# Altium project KVM Switch.PrjPcb
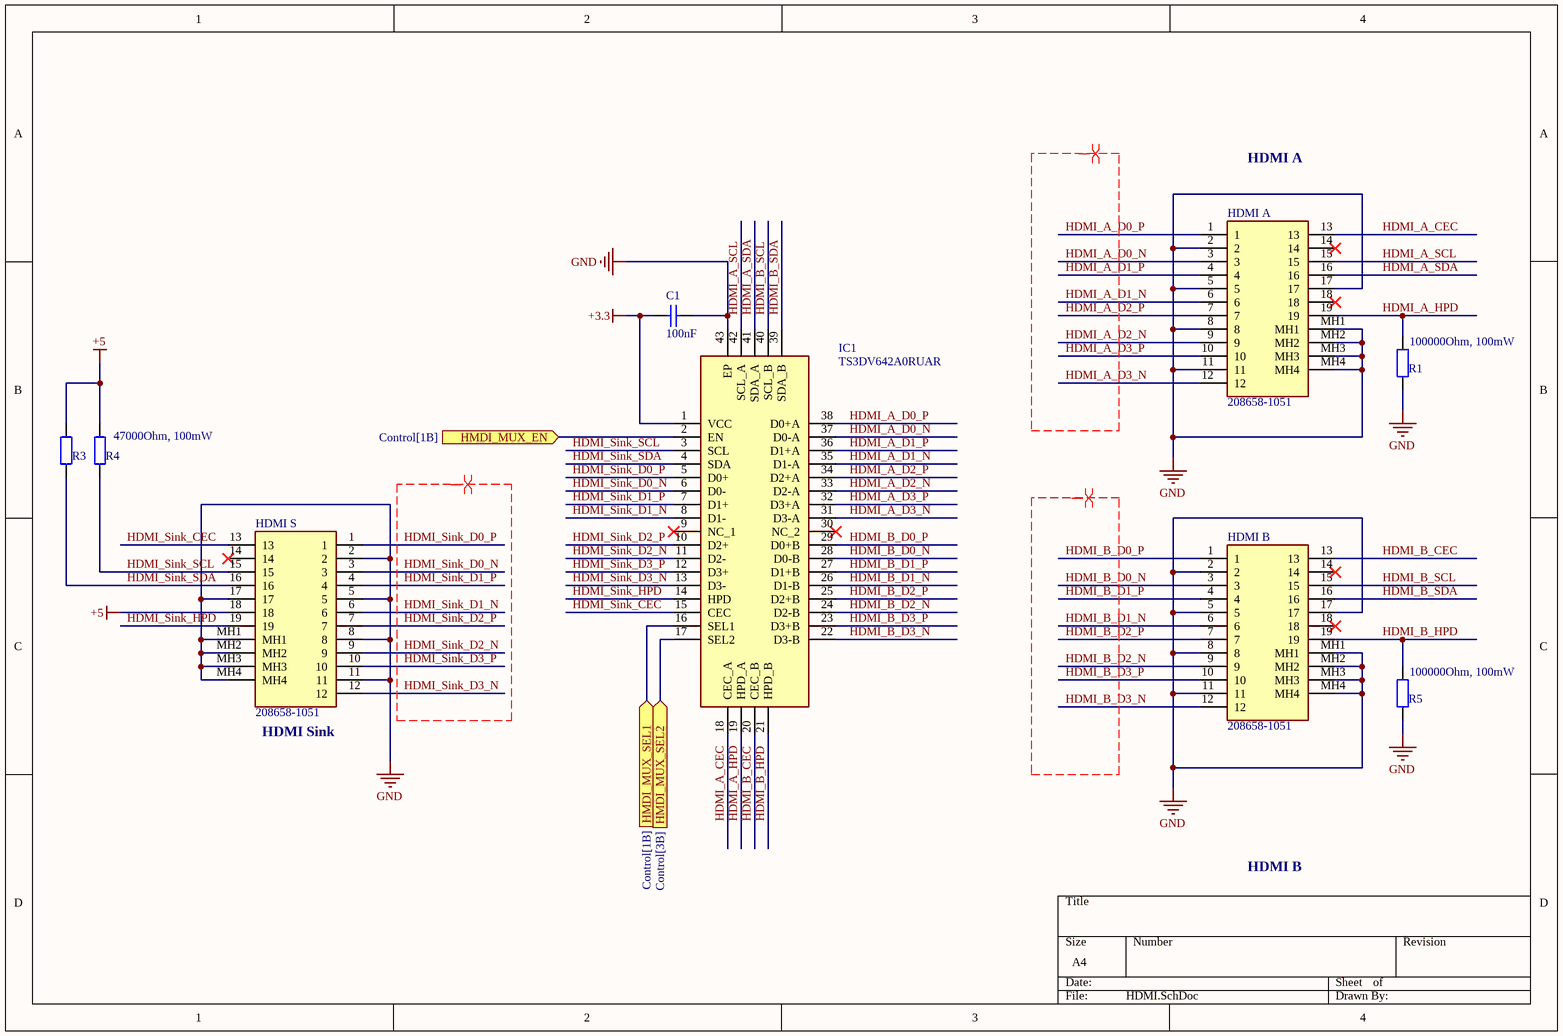
[diagram p0: HDMI.SchDoc]
4 sheets, 45 parts. Net scope: flat (ports and power ports of the same name join across sheets).
Board file: Switch.PcbDoc
Sheets:
  HDMI.SchDoc
  DisplayPort.SchDoc
  USB.SchDoc
  Control.SchDoc

## Sheet HDMI.SchDoc
size A4; SheetNumber: 1; SheetTotal: 4

### Parts
C1  Capacitance: 100nF  [WCAP-CSGP_0402_L1W0.5H0.5]  (hidden comment: 885012205037)
HDMI_A  208658-1051  [2086581051]
HDMI_B  208658-1051  [2086581051]
HDMI_S  208658-1051  [2086581051]
IC1  TS3DV642A0RUAR  [QFN50P350X900X80-43N-D]
R1  100000Ohm, 100mW  [WRIS-RSKS_0402]
R3  47000Ohm, 100mW  [WRIS-RSKS_0402]  (value not drawn)
R4  47000Ohm, 100mW  [WRIS-RSKS_0402]
R5  100000Ohm, 100mW  [WRIS-RSKS_0402]

### Ports
HMDI_MUX_EN (in, see Control[1B]), HMDI_MUX_SEL1 (in, see Control[1B]), HMDI_MUX_SEL2 (in, see Control[3B])

### Nets
+3.3: C1.1 IC1.1(VCC)
+5: HDMI_S.18 R3.2 R4.2
GND: C1.2 HDMI_A.2 HDMI_A.5 HDMI_A.8 HDMI_A.11 HDMI_A.17 HDMI_A.MH1 HDMI_A.MH2 HDMI_A.MH3 HDMI_A.MH4 HDMI_B.2 HDMI_B.5 HDMI_B.8 HDMI_B.11 HDMI_B.17 HDMI_B.MH1 HDMI_B.MH2 HDMI_B.MH3 HDMI_B.MH4 HDMI_S.2 HDMI_S.5 HDMI_S.8 HDMI_S.11 HDMI_S.17 HDMI_S.MH1 HDMI_S.MH2 HDMI_S.MH3 HDMI_S.MH4 IC1.43(EP) R1.1 R5.1
CHANNEL_SELECT: IC1.17(SEL2) ; port HMDI_MUX_SEL2
ENABLE: IC1.2(EN) IC1.16(SEL1) ; port HMDI_MUX_EN, port HMDI_MUX_SEL1
HDMI_A_CEC: HDMI_A.13 IC1.18(CEC_A)
HDMI_A_D0_N: HDMI_A.3 IC1.37(D0-A)
HDMI_A_D0_P: HDMI_A.1 IC1.38(D0+A)
HDMI_A_D1_N: HDMI_A.6 IC1.35(D1-A)
HDMI_A_D1_P: HDMI_A.4 IC1.36(D1+A)
HDMI_A_D2_N: HDMI_A.9 IC1.33(D2-A)
HDMI_A_D2_P: HDMI_A.7 IC1.34(D2+A)
HDMI_A_D3_N: HDMI_A.12 IC1.31(D3-A)
HDMI_A_D3_P: HDMI_A.10 IC1.32(D3+A)
HDMI_A_HPD: HDMI_A.19 IC1.19(HPD_A) R1.2
HDMI_A_SCL: HDMI_A.15 IC1.42(SCL_A)
HDMI_A_SDA: HDMI_A.16 IC1.41(SDA_A)
HDMI_B_CEC: HDMI_B.13 IC1.20(CEC_B)
HDMI_B_D0_N: HDMI_B.3 IC1.28(D0-B)
HDMI_B_D0_P: HDMI_B.1 IC1.29(D0+B)
HDMI_B_D1_N: HDMI_B.6 IC1.26(D1-B)
HDMI_B_D1_P: HDMI_B.4 IC1.27(D1+B)
HDMI_B_D2_N: HDMI_B.9 IC1.24(D2-B)
HDMI_B_D2_P: HDMI_B.7 IC1.25(D2+B)
HDMI_B_D3_N: HDMI_B.12 IC1.22(D3-B)
HDMI_B_D3_P: HDMI_B.10 IC1.23(D3+B)
HDMI_B_HPD: HDMI_B.19 IC1.21(HPD_B) R5.2
HDMI_B_SCL: HDMI_B.15 IC1.40(SCL_B)
HDMI_B_SDA: HDMI_B.16 IC1.39(SDA_B)
HDMI_Sink_CEC: HDMI_S.13 IC1.15(CEC)
HDMI_Sink_D0_N: HDMI_S.3 IC1.6(D0-)
HDMI_Sink_D0_P: HDMI_S.1 IC1.5(D0+)
HDMI_Sink_D1_N: HDMI_S.6 IC1.8(D1-)
HDMI_Sink_D1_P: HDMI_S.4 IC1.7(D1+)
HDMI_Sink_D2_N: HDMI_S.9 IC1.11(D2-)
HDMI_Sink_D2_P: HDMI_S.7 IC1.10(D2+)
HDMI_Sink_D3_N: HDMI_S.12 IC1.13(D3-)
HDMI_Sink_D3_P: HDMI_S.10 IC1.12(D3+)
HDMI_Sink_HPD: HDMI_S.19 IC1.14(HPD)
HDMI_Sink_SCL: HDMI_S.15 IC1.3(SCL) R4.1
HDMI_Sink_SDA: HDMI_S.16 IC1.4(SDA) R3.1

Not connected (* = marked no-connect by the designer): HDMI_A 14* 18*; HDMI_B 14* 18*; HDMI_S 14*; IC1 9(NC_1)* 30(NC_2)*

### Layout directives
differential pair; differential pair class Z100: HDMI_A_D0_N, HDMI_A_D0_P, HDMI_A_D1_N, HDMI_A_D1_P, HDMI_A_D2_N, HDMI_A_D2_P, HDMI_A_D3_N, HDMI_A_D3_P, HDMI_B_D0_N, HDMI_B_D0_P, HDMI_B_D1_N, HDMI_B_D1_P, HDMI_B_D2_N, HDMI_B_D2_P, HDMI_B_D3_N, HDMI_B_D3_P, HDMI_Sink_D0_N, HDMI_Sink_D0_P, HDMI_Sink_D1_N, HDMI_Sink_D1_P, HDMI_Sink_D2_N, HDMI_Sink_D2_P, HDMI_Sink_D3_N, HDMI_Sink_D3_P

### Notes on the sheet
- HDMI A
- (near HDMI_S) HDMI Sink
- HDMI B

### Library data of the parts
C1 = CMP-207839-000001-2: CAP CER 0.1UF 16V X7R 0402; NexarPartId: 53703175; Material: Ceramic; Tolerance: 10%; Insulation Resistance: 5GΩ; Dielectric: X7R; Case/Package: 0402; Voltage Rating (DC): 16V; Max Operating Temperature: 125°C; Width: 500µm; Packaging: Tape & Reel (TR); Height: 500µm; Min Operating Temperature: -55°C; REACH SVHC: Unknown; RoHS: Compliant; Thickness: 558.8µm; Mount: Surface Mount; Voltage Rating: 16V; Case Code (Imperial): 0402; Length: 1mm; Case Code (Metric): 1005
HDMI_A HDMI_B HDMI_S = 208658-1051: Connector; Manufacturer_Name: Molex; Height: 6.44mm; Manufacturer_Part_Number: 208658-1051; Mouser Part Number: 538-208658-1051; Mouser Price/Stock: https://www.mouser.co.uk/ProductDetail/Molex/208658-1051?qs=BJlw7L4Cy7%252Bu27sIkZU3Xw%3D%3D; Arrow Part Number: 208658-1051; Arrow Price/Stock: https://www.arrow.com/en/products/2086581051/molex?region=nac
IC1 = TS3DV642A0RUAR: Integrated Circuit; Manufacturer_Name: Texas Instruments; Datasheet Link: http://www.ti.com/lit/gpn/ts3dv642; Height: 0.8mm; Manufacturer_Part_Number: TS3DV642A0RUAR; Mouser Part Number: 595-TS3DV642A0RUAR; Mouser Price/Stock: https://www.mouser.co.uk/ProductDetail/Texas-Instruments/TS3DV642A0RUAR?qs=zjX5mX%252BjEMCTQjtLUY3z%2FA%3D%3D; Arrow Part Number: TS3DV642A0RUAR; Arrow Price/Stock: https://www.arrow.com/en/products/ts3dv642a0ruar/texas-instruments?region=nac
R1 R5 = 560112110019: WRIS-RSKS Thick Film Resistor, size 0402, 100000Ohm, 100mW; Manufacturer: Wurth Elektronik; Case/Size Code: 0402; Limiting Element Voltage: 50V; Resistance Tolerance: +/-1%; Temperature Coefficient of Resistance Min: -100ppm/°C; Temperature Coefficient of Resistance Max: 100ppm/°C; Manufacturer Part Number: 560112110019; Category: Thick Film Resistors; Match Code: WRIS-RSKS; ComponentLink1Description: Website Link; ComponentLink1URL: https://www.we-online.com/redexpert/article/560112110019?ad; ComponentLink2Description: Datasheet Link; ComponentLink2URL: https://www.we-online.com/redexpert/spec/560112110019?ad; Mount: Surface Mount; Operating Temperature Max: 155°C; Operating Temperature Min: -55°C; Packaging: Tape and Reel; Length: 1mm; Width: 0.5mm; Height: 0.35mm; Rated Power: 100mW; Resistance: 100000Ohm
R3 R4 = 560112110055: WRIS-RSKS Thick Film Resistor, size 0402, 47000Ohm, 100mW; Manufacturer: Wurth Elektronik; Case/Size Code: 0402; Limiting Element Voltage: 50V; Resistance Tolerance: +/-1%; Temperature Coefficient of Resistance Min: -100ppm/°C; Temperature Coefficient of Resistance Max: 100ppm/°C; Manufacturer Part Number: 560112110055; Category: Thick Film Resistors; Match Code: WRIS-RSKS; ComponentLink1Description: Website Link; ComponentLink1URL: https://www.we-online.com/redexpert/article/560112110055?ad; ComponentLink2Description: Datasheet Link; ComponentLink2URL: https://www.we-online.com/redexpert/spec/560112110055?ad; Mount: Surface Mount; Operating Temperature Max: 155°C; Operating Temperature Min: -55°C; Packaging: Tape and Reel; Length: 1mm; Width: 0.5mm; Height: 0.35mm; Rated Power: 100mW; Resistance: 47000Ohm

## Sheet DisplayPort.SchDoc
size A4; SheetNumber: 2; SheetTotal: 4
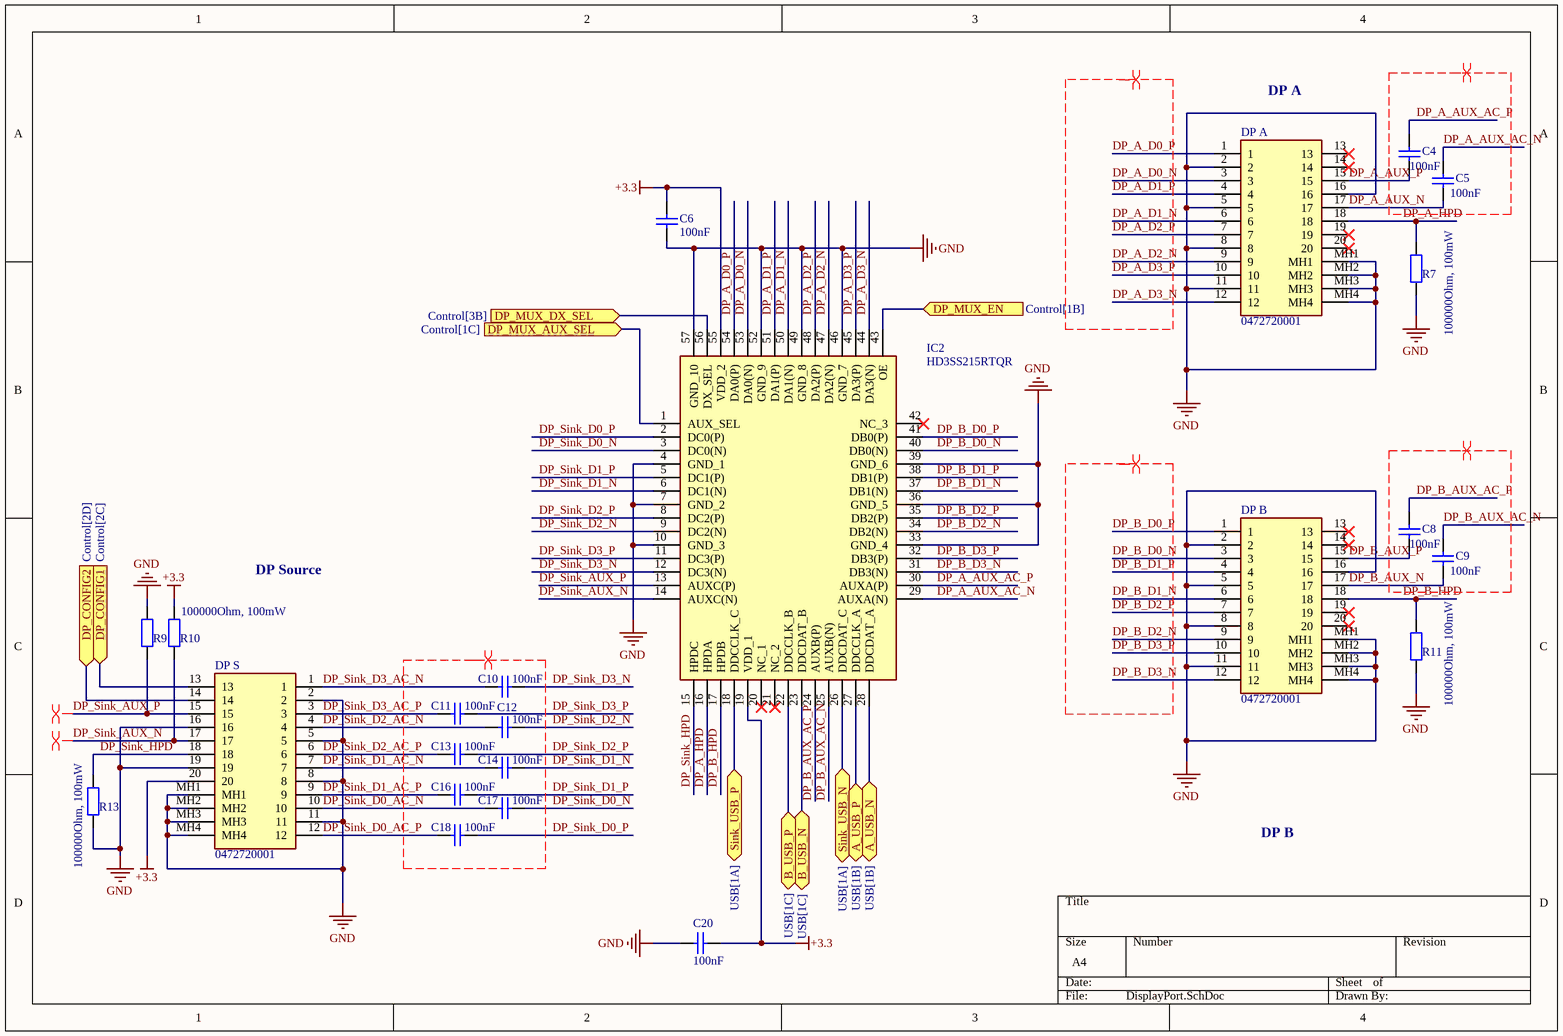
[diagram p1: DisplayPort.SchDoc]

### Parts
C4  Capacitance: 100nF  [WCAP-CSGP_0402_L1W0.5H0.5]  (hidden comment: 885012205037)
C5  Capacitance: 100nF  [WCAP-CSGP_0402_L1W0.5H0.5]  (hidden comment: 885012205037)
C6  Capacitance: 100nF  [WCAP-CSGP_0402_L1W0.5H0.5]  (hidden comment: 885012205037)
C8  Capacitance: 100nF  [WCAP-CSGP_0402_L1W0.5H0.5]  (hidden comment: 885012205037)
C9  Capacitance: 100nF  [WCAP-CSGP_0402_L1W0.5H0.5]  (hidden comment: 885012205037)
C10  Capacitance: 100nF  [WCAP-CSGP_0402_L1W0.5H0.5]  (hidden comment: 885012205037)
C11  Capacitance: 100nF  [WCAP-CSGP_0402_L1W0.5H0.5]  (hidden comment: 885012205037)
C12  Capacitance: 100nF  [WCAP-CSGP_0402_L1W0.5H0.5]  (hidden comment: 885012205037)
C13  Capacitance: 100nF  [WCAP-CSGP_0402_L1W0.5H0.5]  (hidden comment: 885012205037)
C14  Capacitance: 100nF  [WCAP-CSGP_0402_L1W0.5H0.5]  (hidden comment: 885012205037)
C16  Capacitance: 100nF  [WCAP-CSGP_0402_L1W0.5H0.5]  (hidden comment: 885012205037)
C17  Capacitance: 100nF  [WCAP-CSGP_0402_L1W0.5H0.5]  (hidden comment: 885012205037)
C18  Capacitance: 100nF  [WCAP-CSGP_0402_L1W0.5H0.5]  (hidden comment: 885012205037)
C20  Capacitance: 100nF  [WCAP-CSGP_0402_L1W0.5H0.5]  (hidden comment: 885012205037)
DP_A  0472720001  [0472720001]
DP_B  0472720001  [0472720001]
DP_S  0472720001  [0472720001]
IC2  HD3SS215RTQR  [QFN50P800X800X100-57N-D]
R7  100000Ohm, 100mW  [WRIS-RSKS_0402]
R9  100000Ohm, 100mW  [WRIS-RSKS_0402]  (value not drawn)
R10  100000Ohm, 100mW  [WRIS-RSKS_0402]
R11  100000Ohm, 100mW  [WRIS-RSKS_0402]
R13  100000Ohm, 100mW  [WRIS-RSKS_0402]

### Ports
A_USB_N (bidir, see USB[1B]), A_USB_P (bidir, see USB[1B]), B_USB_N (bidir, see USB[1C]), B_USB_P (bidir, see USB[1C]), DP_CONFIG1 (in, see Control[2C]), DP_CONFIG2 (in, see Control[2D]), DP_MUX_AUX_SEL (in, see Control[1C]), DP_MUX_DX_SEL (in, see Control[3B]), DP_MUX_EN (in, see Control[1B]), Sink_USB_N (bidir, see USB[1A]), Sink_USB_P (bidir, see USB[1A])

### Nets
+3.3: C6.1 C20.2 DP_S.20 IC2.19(VDD_1) IC2.55(VDD_2) R10.2
GND: C6.2 C20.1 DP_A.2 DP_A.5 DP_A.8 DP_A.11 DP_A.16 DP_A.MH1 DP_A.MH2 DP_A.MH3 DP_A.MH4 DP_B.2 DP_B.5 DP_B.8 DP_B.11 DP_B.16 DP_B.MH1 DP_B.MH2 DP_B.MH3 DP_B.MH4 DP_S.2 DP_S.5 DP_S.8 DP_S.11 DP_S.16 DP_S.19 DP_S.MH1 DP_S.MH2 DP_S.MH3 DP_S.MH4 IC2.4(GND_1) IC2.7(GND_2) IC2.10(GND_3) IC2.33(GND_4) IC2.36(GND_5) IC2.39(GND_6) IC2.46(GND_7) IC2.49(GND_8) IC2.52(GND_9) IC2.57(GND_10) R7.1 R9.2 R11.1 R13.1
A_USB_N: IC2.28(DDCDAT_A) ; port A_USB_N
A_USB_P: IC2.27(DDCCLK_A) ; port A_USB_P
B_USB_N: IC2.23(DDCDAT_B) ; port B_USB_N
B_USB_P: IC2.22(DDCCLK_B) ; port B_USB_P
CHANNEL_SELECT: IC2.56(DX_SEL) ; port DP_MUX_DX_SEL
DP_A_AUX_AC_N: C5.2 IC2.29(AUXA(N))
DP_A_AUX_AC_P: C4.2 IC2.30(AUXA(P))
DP_A_AUX_N: C5.1 DP_A.17
DP_A_AUX_P: C4.1 DP_A.15
DP_A_D0_N: DP_A.3 IC2.53(DA0(N))
DP_A_D0_P: DP_A.1 IC2.54(DA0(P))
DP_A_D1_N: DP_A.6 IC2.50(DA1(N))
DP_A_D1_P: DP_A.4 IC2.51(DA1(P))
DP_A_D2_N: DP_A.9 IC2.47(DA2(N))
DP_A_D2_P: DP_A.7 IC2.48(DA2(P))
DP_A_D3_N: DP_A.12 IC2.44(DA3(N))
DP_A_D3_P: DP_A.10 IC2.45(DA3(P))
DP_A_HPD: DP_A.18 IC2.16(HPDA) R7.2
DP_B_AUX_AC_N: C9.2 IC2.25(AUXB(N))
DP_B_AUX_AC_P: C8.2 IC2.24(AUXB(P))
DP_B_AUX_N: C9.1 DP_B.17
DP_B_AUX_P: C8.1 DP_B.15
DP_B_D0_N: DP_B.3 IC2.40(DB0(N))
DP_B_D0_P: DP_B.1 IC2.41(DB0(P))
DP_B_D1_N: DP_B.6 IC2.37(DB1(N))
DP_B_D1_P: DP_B.4 IC2.38(DB1(P))
DP_B_D2_N: DP_B.9 IC2.34(DB2(N))
DP_B_D2_P: DP_B.7 IC2.35(DB2(P))
DP_B_D3_N: DP_B.12 IC2.31(DB3(N))
DP_B_D3_P: DP_B.10 IC2.32(DB3(P))
DP_B_HPD: DP_B.18 IC2.17(HPDB) R11.2
DP_CONFIG1: DP_S.13 ; port DP_CONFIG1
DP_CONFIG2: DP_S.14 ; port DP_CONFIG2
DP_MUX_AUX_SEL: IC2.1(AUX_SEL) ; port DP_MUX_AUX_SEL
DP_Sink_AUX_N: DP_S.17 IC2.14(AUXC(N)) R10.1
DP_Sink_AUX_P: DP_S.15 IC2.13(AUXC(P)) R9.1
DP_Sink_D0_AC_N: C17.2 DP_S.10
DP_Sink_D0_AC_P: C18.2 DP_S.12
DP_Sink_D0_N: C17.1 IC2.3(DC0(N))
DP_Sink_D0_P: C18.1 IC2.2(DC0(P))
DP_Sink_D1_AC_N: C14.2 DP_S.7
DP_Sink_D1_AC_P: C16.2 DP_S.9
DP_Sink_D1_N: C14.1 IC2.6(DC1(N))
DP_Sink_D1_P: C16.1 IC2.5(DC1(P))
DP_Sink_D2_AC_N: C12.2 DP_S.4
DP_Sink_D2_AC_P: C13.2 DP_S.6
DP_Sink_D2_N: C12.1 IC2.9(DC2(N))
DP_Sink_D2_P: C13.1 IC2.8(DC2(P))
DP_Sink_D3_AC_N: C10.2 DP_S.1
DP_Sink_D3_AC_P: C11.2 DP_S.3
DP_Sink_D3_N: C10.1 IC2.12(DC3(N))
DP_Sink_D3_P: C11.1 IC2.11(DC3(P))
DP_Sink_HPD: DP_S.18 IC2.15(HPDC) R13.2
ENABLE: IC2.43(OE) ; port DP_MUX_EN
Sink_USB_N: IC2.26(DDCDAT_C) ; port Sink_USB_N
Sink_USB_P: IC2.18(DDCCLK_C) ; port Sink_USB_P

Not connected (* = marked no-connect by the designer): DP_A 13* 14* 19* 20*; DP_B 13* 14* 19* 20*; IC2 20(NC_1)* 21(NC_2)* 42(NC_3)*

### Layout directives
differential pair; differential pair class Z100: (no net found under the mark), DP_A_AUX_AC_N, DP_A_AUX_AC_P, DP_A_D0_N, DP_A_D0_P, DP_A_D1_N, DP_A_D1_P, DP_A_D2_N, DP_A_D2_P, DP_A_D3_N, DP_A_D3_P, DP_B_AUX_AC_N, DP_B_AUX_AC_P, DP_B_D0_N, DP_B_D0_P, DP_B_D1_N, DP_B_D1_P, DP_B_D2_N, DP_B_D2_P, DP_B_D3_N, DP_B_D3_P, DP_Sink_AUX_N, DP_Sink_AUX_P

### Notes on the sheet
- DP A
- DP Source
- DP B

### Library data of the parts
C4-C6 C8-C14 C16-C18 C20 = CMP-207839-000001-2: as C1 on sheet HDMI; Dielectric: X7R; Case/Package: 0402; Voltage Rating (DC): 16V; Max Operating Temperature: 125°C; Width: 500µm; Packaging: Tape & Reel (TR); Height: 500µm; Min Operating Temperature: -55°C; REACH SVHC: Unknown; RoHS: Compliant; Thickness: 558.8µm; Mount: Surface Mount; Voltage Rating: 16V; Case Code (Imperial): 0402; Length: 1mm; Case Code (Metric): 1005
DP_A DP_B DP_S = 0472720001: Connector; Manufacturer_Name: Molex; Datasheet Link: http://www.molex.com/pdm_docs/sd/472720001_sd.pdf; Height: 6.9mm; Manufacturer_Part_Number: 0472720001; Mouser Part Number: N/A; Mouser Price/Stock: https://www.mouser.co.uk/ProductDetail/Molex/0472720001?qs=PBcRNPEHKsrarbeLf7n8sg%3D%3D; Arrow Part Number: 0472720001; Arrow Price/Stock: https://www.arrow.com/en/products/0472720001/molex?region=europe
IC2 = HD3SS215RTQR: Integrated Circuit; Manufacturer_Name: Texas Instruments; Datasheet Link: http://www.ti.com/lit/gpn/hd3ss215; Height: 1mm; Manufacturer_Part_Number: HD3SS215RTQR; Mouser Part Number: 595-HD3SS215RTQR; Mouser Price/Stock: https://www.mouser.co.uk/ProductDetail/Texas-Instruments/HD3SS215RTQR?qs=7z%252BmIopC6%2FI%2F794hSmEgIA%3D%3D; Arrow Part Number: HD3SS215RTQR; Arrow Price/Stock: https://www.arrow.com/en/products/hd3ss215rtqr/texas-instruments?region=nac
R7 R9-R11 R13 = 560112110019: as R1 on sheet HDMI; Manufacturer Part Number: 560112110019; Category: Thick Film Resistors; Match Code: WRIS-RSKS; ComponentLink1Description: Website Link; ComponentLink1URL: https://www.we-online.com/redexpert/article/560112110019?ad; ComponentLink2Description: Datasheet Link; ComponentLink2URL: https://www.we-online.com/redexpert/spec/560112110019?ad; Mount: Surface Mount; Operating Temperature Max: 155°C; Operating Temperature Min: -55°C; Packaging: Tape and Reel; Length: 1mm; Width: 0.5mm; Height: 0.35mm; Rated Power: 100mW; Resistance: 100000Ohm

## Sheet USB.SchDoc
size A4; SheetNumber: 3; SheetTotal: 4
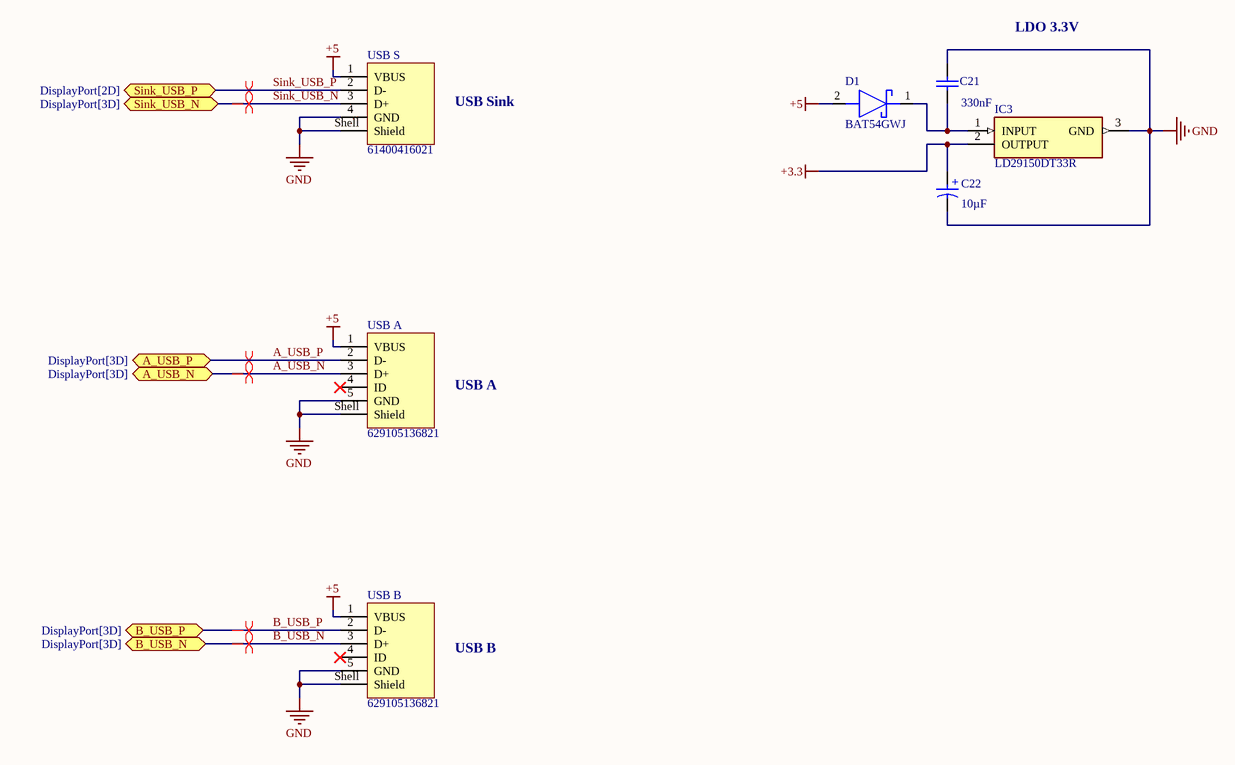
[diagram p2: USB.SchDoc]

### Parts
C21  Capacitance: 330nF  [WCAP-CSGP_0603_L1.6W0.8H0.8_Reflow]  (hidden comment: 885012206023)
C22  Capacitance: 10µF  [WCAP-ASLI_D4H5.5]  (hidden comment: 865080340001)
D1  BAT54GWJ  [SOD123]
IC3  LD29150DT33R  [ST_DPAK_1]
USB_A  629105136821  [629105136821]
USB_B  629105136821  [629105136821]
USB_S  61400416021  [61400416021]

### Ports
A_USB_N (bidir, see DisplayPort[3D]), A_USB_P (bidir, see DisplayPort[3D]), B_USB_N (bidir, see DisplayPort[3D]), B_USB_P (bidir, see DisplayPort[3D]), Sink_USB_N (bidir, see DisplayPort[3D]), Sink_USB_P (bidir, see DisplayPort[2D])

### Nets
+3.3: C22.1(P) IC3.2(OUTPUT)
+5: D1.2(A) USB_A.1(VBUS) USB_B.1(VBUS) USB_S.1(VBUS)
GND: C21.2 C22.2(N) IC3.3(GND) USB_A.5(GND) USB_A.Shell(Shield) USB_B.5(GND) USB_B.Shell(Shield) USB_S.4(GND) USB_S.Shell(Shield)
A_USB_N: USB_A.3(D+) ; port A_USB_N
A_USB_P: USB_A.2(D-) ; port A_USB_P
B_USB_N: USB_B.3(D+) ; port B_USB_N
B_USB_P: USB_B.2(D-) ; port B_USB_P
Sink_USB_N: USB_S.3(D+) ; port Sink_USB_N
Sink_USB_P: USB_S.2(D-) ; port Sink_USB_P
NetC21_1: C21.1 D1.1(K) IC3.1(INPUT)

Not connected (* = marked no-connect by the designer): USB_A 4(ID)*; USB_B 4(ID)*

### Layout directives
differential pair; differential pair class USB_Sink: Sink_USB_N, Sink_USB_P
differential pair; differential pair class USB_A: A_USB_N, A_USB_P
differential pair; differential pair class USB_B: B_USB_N, B_USB_P

### Notes on the sheet
- LDO 3.3V
- USB Sink
- USB A
- USB B
- (in symbol CMP-03913-53914566-1) +

### Library data of the parts
C21 = CMP-03913-53914732-1: 885012206023 Ceramic Capacitor 330nF, 10VDC, 0603, ±10 %; Voltage Rating: 10V; Tolerance: 10%; Insulation Resistance: 1.5GΩ; Dielectric: X7R; Packaging: Tape & Reel (TR); Case Code (Metric): 1608; Length: 1.6mm; Height: 800µm; Thickness: 939.8µm; Voltage Rating (DC): 10V; NexarPartId: 53914732; Min Operating Temperature: -55°C; Mount: Surface Mount; Case Code (Imperial): 0603; Width: 800µm; Case/Package: 0603; Max Operating Temperature: 125°C; RoHS: Compliant
C22 = CMP-03913-53914566-1: 865080340001 WCAP-ASLI Aluminum Electrolytic Capacitors; Impedance: 2.2Ω; ESR (Equivalent Series Resistance): 1.66693Ω; Life (Hours): 2000hours; Ripple Current (AC): 80mA; Voltage Rating (DC): 16V; Polarity: Polar; Leakage Current: 3µA; Insulation Resistance: 5.33333MΩ; Tolerance: 20%; Case/Package: Radial; Min Operating Temperature: -55°C; Height: 5.5mm; Lead Free: Lead Free; Packaging: Tape & Reel (TR); REACH SVHC: Unknown; Length: 5.5mm; Height - Seated (Max): 5.5118mm; Max Operating Temperature: 105°C; NexarPartId: 53914566; Diameter: 4mm; Ripple Current: 80mA; Mount: Surface Mount; RoHS: Compliant; Voltage Rating: 16V; Width: 4.3mm
D1 = BAT54GWJ: Schottky Diode; Manufacturer_Name: Nexperia; Datasheet Link: https://assets.nexperia.com/documents/data-sheet/BAT54GW.pdf; Manufacturer_Part_Number: BAT54GWJ; Mouser Part Number: 841-BAT54GWJ; Mouser Price/Stock: https://www.mouser.co.uk/ProductDetail/Nexperia/BAT54GWJ?qs=EO%252B2iqeaG03qzVr9l4ml1Q%3D%3D; Arrow Part Number: BAT54GWJ; Arrow Price/Stock: https://www.arrow.com/en/products/bat54gwj/nexperia?region=europe
IC3 = LD29150DT33R: Integrated Circuit; Manufacturer_Name: STMicroelectronics; Datasheet Link: http://www.st.com/web/en/resource/technical/document/datasheet/CD00003403.pdf; Manufacturer_Part_Number: LD29150DT33R; Mouser Part Number: 511-LD29150DT33R; Mouser Price/Stock: https://www.mouser.co.uk/ProductDetail/STMicroelectronics/LD29150DT33R?qs=M4RLcaOHglr1iYLz8rxZ4g%3D%3D; Arrow Part Number: LD29150DT33R; Arrow Price/Stock: https://www.arrow.com/en/products/ld29150dt33r/stmicroelectronics?region=nac
USB_A USB_B = CMP-1502-03253-2: NexarPartId: 19991173; Insulation Resistance: 1GΩ; Contact Resistance: 30mΩ; Number of Contacts: 5; Number of Ports: 1; Gender: Receptacle; Current Rating: 1A; Connector Type: USB; Voltage Rating: 30V; USB Standard: USB 2.0; Plating: Nickel; Max Operating Temperature: 105°C; Orientation: Horizontal; Height: 2.9mm; Termination: Solder; Min Operating Temperature: -40°C; Number of Pins: 5; Flammability Rating: UL94 V-0; Lead Free: Lead Free; Packaging: Tape and Reel; Contact Plating: Gold; RoHS: Compliant; Mount: Horizontal, Surface Mount; Color: Black; REACH SVHC: Unknown; Operating Supply Voltage: 30V; Contact Material: Copper; Number of Positions: 5; Length: 5.9mm
USB_S = CMP-1502-03227-2: NexarPartId: 21041530; Contact Resistance: 20mΩ; Gender: Receptacle; Voltage Rating (DC): 30V; Current Rating: 1.5A; Connector Type: USB; Insulation Resistance: 1GΩ; USB Standard: USB 2.0; Number of Contacts: 4; Number of Ports: 1; Width: 14.4mm; REACH SVHC: Unknown; Contact Plating: Gold; Length: 15.8mm; Lead Free: Lead Free; Max Operating Temperature: 105°C; Orientation: Horizontal; Contact Material: Copper; Voltage Rating: 30V; Min Operating Temperature: -40°C; Flammability Rating: UL94 V-0; Color: White; RoHS: Compliant; Number of Pins: 4; Mount: Horizontal, Through Hole; Number of Positions: 4; Operating Supply Voltage: 30V; Insulation Material: PBT; Termination: Solder

## Sheet Control.SchDoc
size A4; SheetNumber: 4; SheetTotal: 4
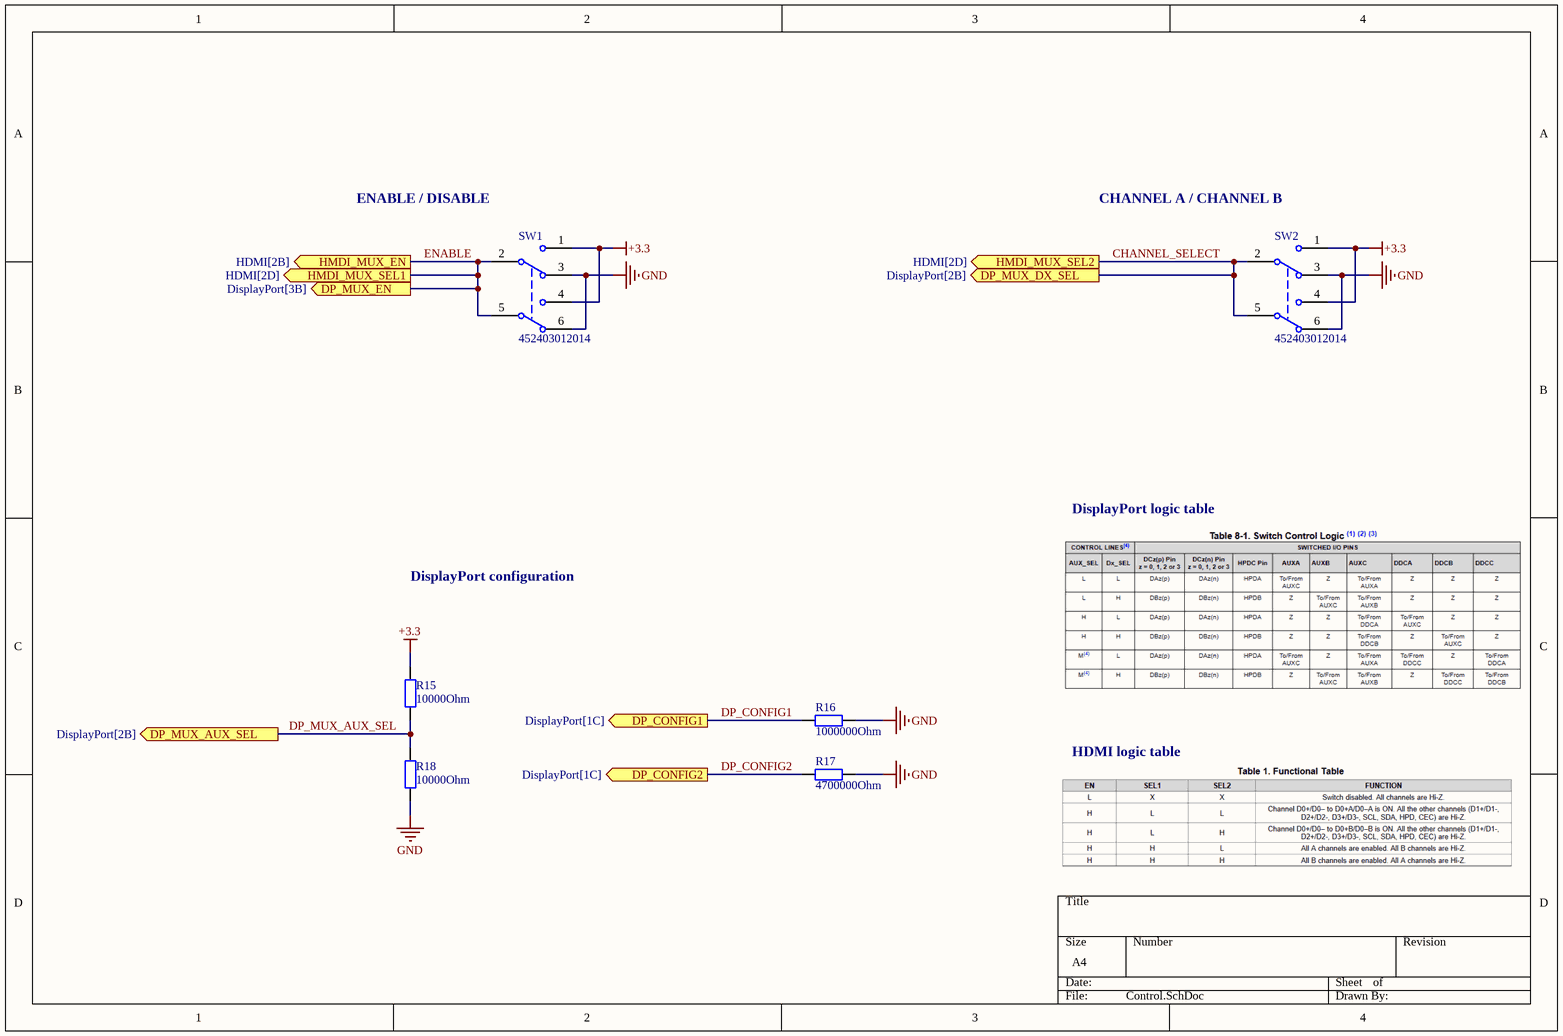
[diagram p3: Control.SchDoc]

### Parts
R15  Resistance: 10000Ohm  [WRIS-RSKS_0402]  (hidden comment: 10000Ohm, 100mW)
R16  Resistance: 1000000Ohm  [WRIS-RSKS_0402]  (hidden comment: 1000000Ohm, 100mW)
R17  Resistance: 4700000Ohm  [WRIS-RSKS_1206_Reflow]  (hidden comment: 4700000Ohm, 250mW)
R18  Resistance: 10000Ohm  [WRIS-RSKS_0402]  (hidden comment: 10000Ohm, 100mW)
SW1  452403012014  [452403012014]
SW2  452403012014  [452403012014]

### Ports
DP_CONFIG1 (out, see DisplayPort[1C]), DP_CONFIG2 (out, see DisplayPort[1C]), DP_MUX_AUX_SEL (out, see DisplayPort[2B]), DP_MUX_DX_SEL (out, see DisplayPort[2B]), DP_MUX_EN (out, see DisplayPort[3B]), HMDI_MUX_EN (out, see HDMI[2B]), HMDI_MUX_SEL1 (out, see HDMI[2D]), HMDI_MUX_SEL2 (out, see HDMI[2D])

### Nets
+3.3: R15.2 SW1.1 SW1.4 SW2.1 SW2.4
GND: R16.1 R17.1 R18.1 SW1.3 SW1.6 SW2.3 SW2.6
CHANNEL_SELECT: SW2.2(COM) SW2.5(COM) ; port DP_MUX_DX_SEL, port HMDI_MUX_SEL2
DP_CONFIG1: R16.2 ; port DP_CONFIG1
DP_CONFIG2: R17.2 ; port DP_CONFIG2
DP_MUX_AUX_SEL: R15.1 R18.2 ; port DP_MUX_AUX_SEL
ENABLE: SW1.2(COM) SW1.5(COM) ; port HMDI_MUX_EN, port HMDI_MUX_SEL1, port DP_MUX_EN

### Notes on the sheet
- ENABLE / DISABLE
- (near SW2) CHANNEL A / CHANNEL B
- DisplayPort logic table
- DisplayPort configuration
- HDMI logic table

### Library data of the parts
R15 R18 = 560112110020: WRIS-RSKS Thick Film Resistor, size 0402, 10000Ohm, 100mW; Manufacturer: Wurth Elektronik; Case/Size Code: 0402; Limiting Element Voltage: 50V; Resistance Tolerance: +/-1%; Temperature Coefficient of Resistance Min: -100ppm/°C; Temperature Coefficient of Resistance Max: 100ppm/°C; Manufacturer Part Number: 560112110020; Category: Thick Film Resistors; Match Code: WRIS-RSKS; ComponentLink1Description: Website Link; ComponentLink1URL: https://www.we-online.com/redexpert/article/560112110020?ad; ComponentLink2Description: Datasheet Link; ComponentLink2URL: https://www.we-online.com/redexpert/spec/560112110020?ad; Mount: Surface Mount; Operating Temperature Max: 155°C; Operating Temperature Min: -55°C; Packaging: Tape and Reel; Length: 1mm; Width: 0.5mm; Height: 0.35mm; Rated Power: 100mW
R16 = 560112110033: WRIS-RSKS Thick Film Resistor, size 0402, 1000000Ohm, 100mW; Manufacturer: Wurth Elektronik; Case/Size Code: 0402; Limiting Element Voltage: 50V; Resistance Tolerance: +/-1%; Temperature Coefficient of Resistance Min: -100ppm/°C; Temperature Coefficient of Resistance Max: 100ppm/°C; Manufacturer Part Number: 560112110033; Category: Thick Film Resistors; Match Code: WRIS-RSKS; ComponentLink1Description: Website Link; ComponentLink1URL: https://www.we-online.com/redexpert/article/560112110033?ad; ComponentLink2Description: Datasheet Link; ComponentLink2URL: https://www.we-online.com/redexpert/spec/560112110033?ad; Mount: Surface Mount; Operating Temperature Max: 155°C; Operating Temperature Min: -55°C; Packaging: Tape and Reel; Length: 1mm; Width: 0.5mm; Height: 0.35mm; Rated Power: 100mW
R17 = 560112132029: WRIS-RSKS Thick Film Resistor, size 1206, 4700000Ohm, 250mW; Manufacturer: Wurth Elektronik; Case/Size Code: 1206; Limiting Element Voltage: 200V; Resistance Tolerance: +/-1%; Temperature Coefficient of Resistance Min: -200ppm/°C; Temperature Coefficient of Resistance Max: 200ppm/°C; Manufacturer Part Number: 560112132029; Category: Thick Film Resistors; Match Code: WRIS-RSKS; ComponentLink1Description: Website Link; ComponentLink1URL: https://www.we-online.com/redexpert/article/560112132029?ad; ComponentLink2Description: Datasheet Link; ComponentLink2URL: https://www.we-online.com/redexpert/spec/560112132029?ad; Mount: Surface Mount; Operating Temperature Max: 155°C; Operating Temperature Min: -55°C; Packaging: Tape and Reel; Length: 3.1mm; Width: 1.6mm; Height: 0.6mm; Rated Power: 250mW
SW1 SW2 = CMP-03913-71472420-1: 452403012014 Slide Switch, Dpdt, 0.3A, 6Vdc, Smd Rohs Compliant: Yes; Voltage Rating: 6V; Switch Function: On-On; Actuator Length: 1.2mm; Switch Travel: 2mm; Current Rating: 300mA; Insulation Resistance: 100MΩ; Actuator Material: Liquid Crystal Polymer, Polymer; Contact Style: Non-Shorting; Termination: SMD/SMT; Mount: Surface Mount; Min Operating Temperature: -40°C; Contact Plating: Silver; RoHS: Compliant; Color: Silver; Throw Configuration: DPDT; Voltage Rating (DC): 6V; Max Operating Temperature: 85°C; NexarPartId: 71472420; Packaging: Tape and Reel

## Nets that join several sheets
+3.3: HDMI (C1.1 IC1.1), DisplayPort (6 pins), USB (C22.1 IC3.2), Control (5 pins)
+5: HDMI (HDMI_S.18 R3.2 R4.2), USB (D1.2 USB_A.1 USB_B.1 USB_S.1)
GND: HDMI (31 pins), DisplayPort (44 pins), USB (9 pins), Control (7 pins)
A_USB_N: DisplayPort (IC2.28), USB (USB_A.3)
A_USB_P: DisplayPort (IC2.27), USB (USB_A.2)
B_USB_N: DisplayPort (IC2.23), USB (USB_B.3)
B_USB_P: DisplayPort (IC2.22), USB (USB_B.2)
CHANNEL_SELECT: HDMI (IC1.17), DisplayPort (IC2.56), Control (SW2.2 SW2.5)
DP_CONFIG1: DisplayPort (DP_S.13), Control (R16.2)
DP_CONFIG2: DisplayPort (DP_S.14), Control (R17.2)
DP_MUX_AUX_SEL: DisplayPort (IC2.1), Control (R15.1 R18.2)
ENABLE: HDMI (IC1.2 IC1.16), DisplayPort (IC2.43), Control (SW1.2 SW1.5)
Sink_USB_N: DisplayPort (IC2.26), USB (USB_S.3)
Sink_USB_P: DisplayPort (IC2.18), USB (USB_S.2)